# Altium schematic sheet Car.SchDoc
size A3; SheetNumber: 1; SheetTotal: 1
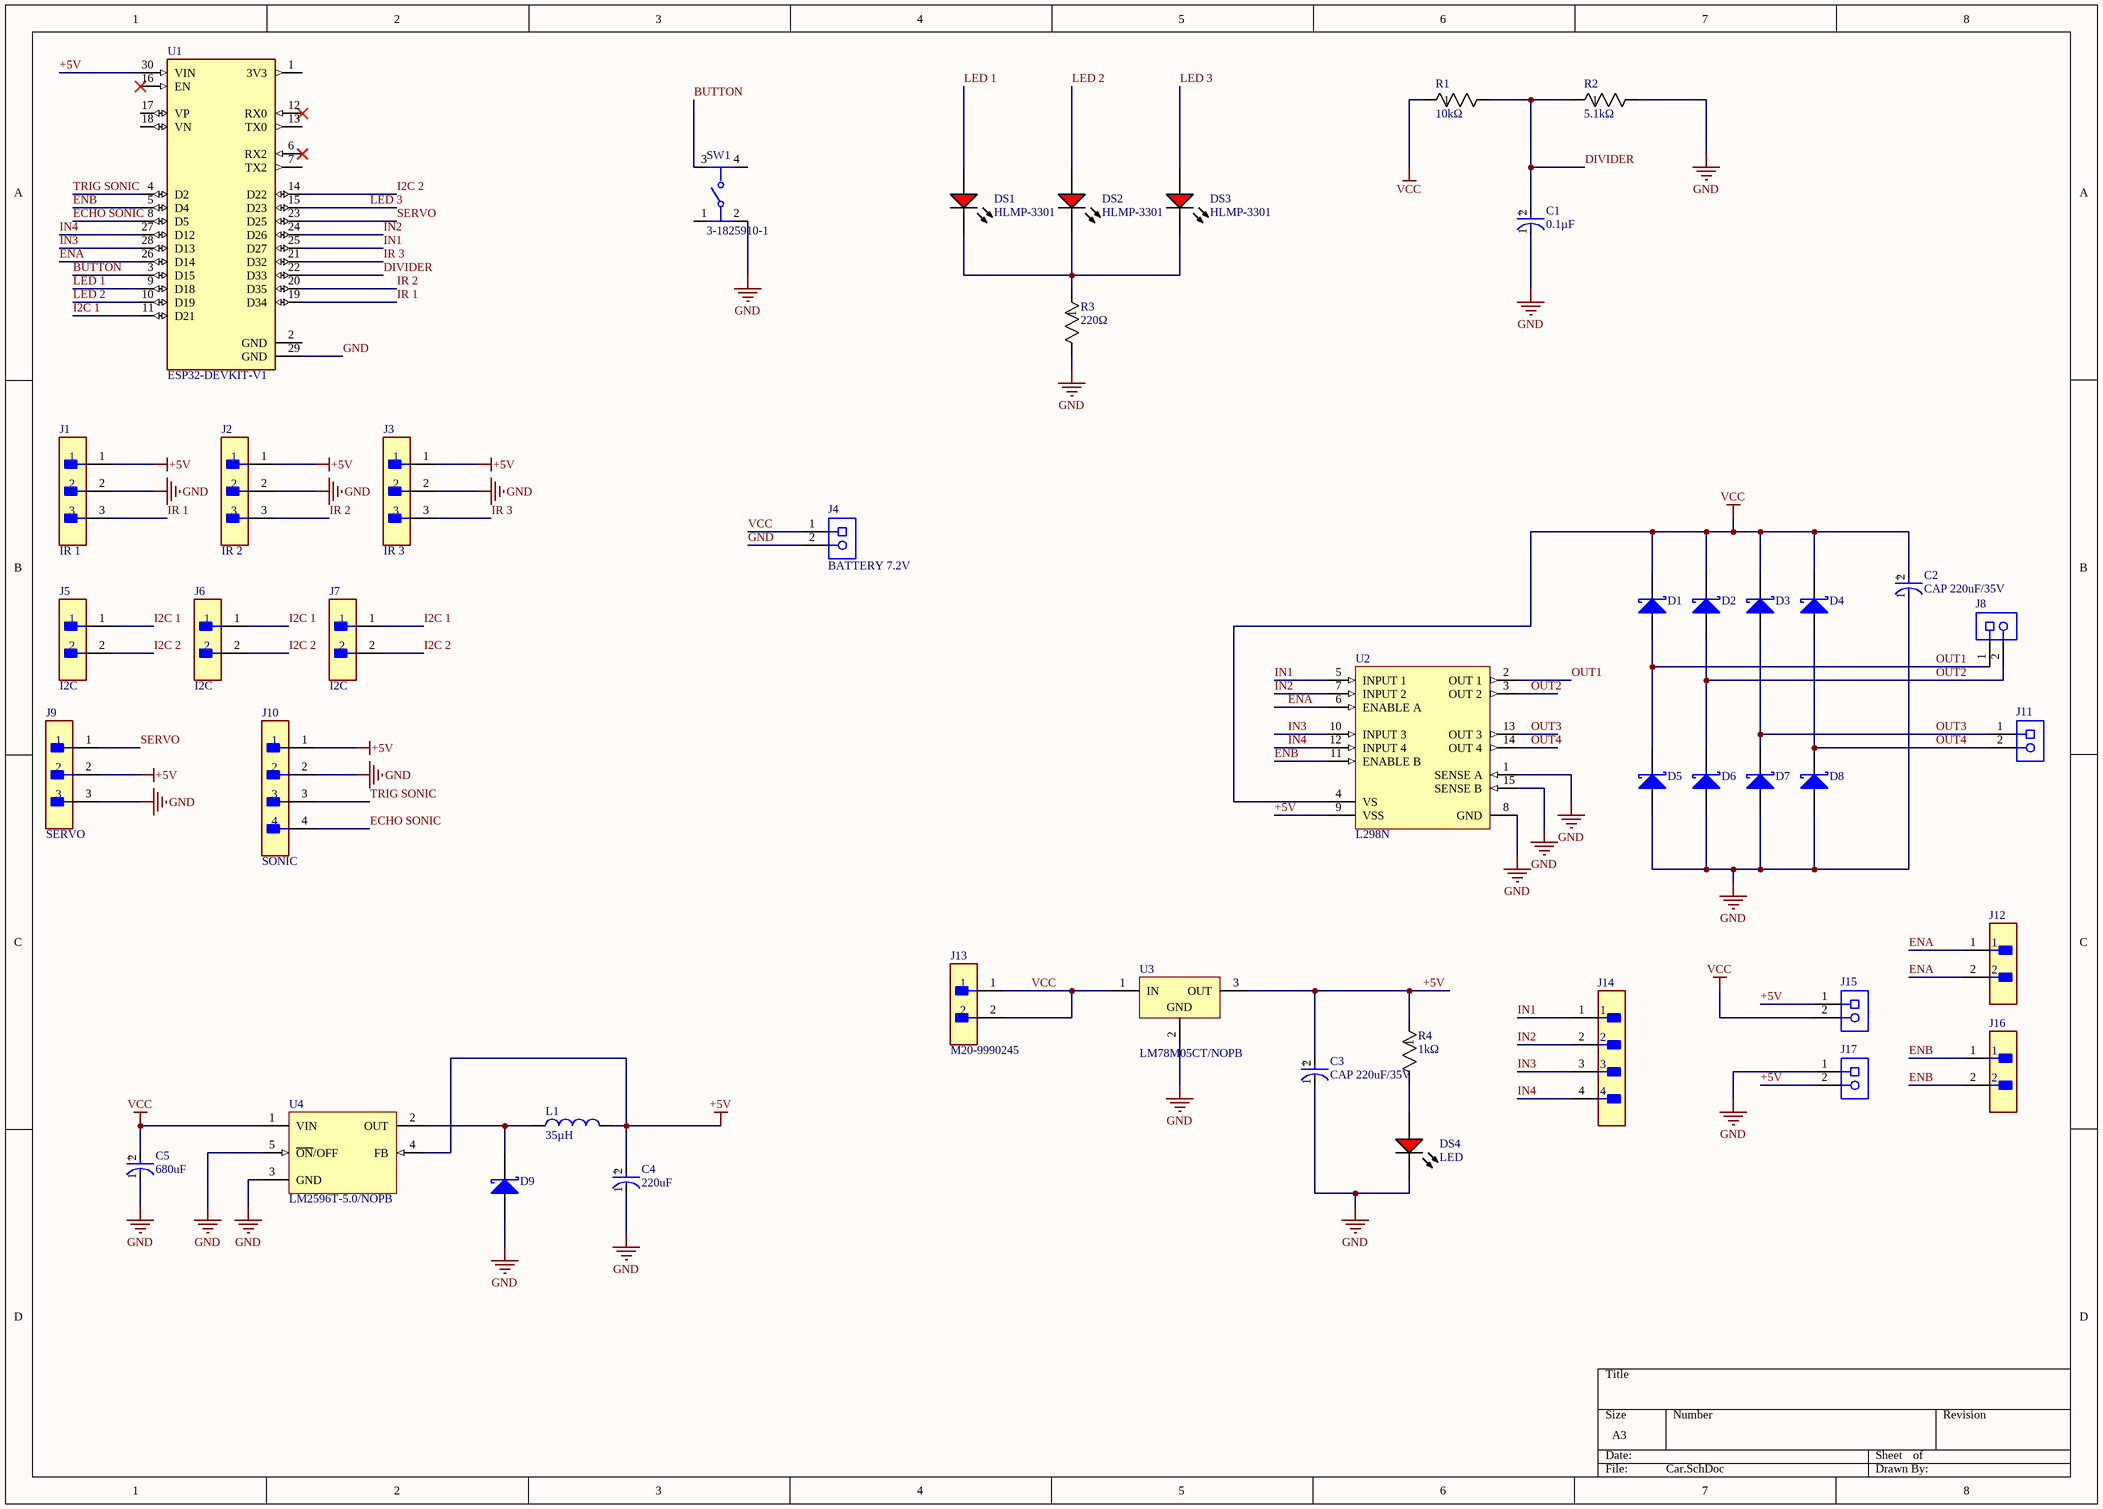
[diagram p0: Car.SchDoc]

## Parts
C1  0.1µF  [FP-EEU-FR1H101B-MFG]
C2  CAP 220uF/35V  [FP-EEU-FR1H101B-MFG]
C3  CAP 220uF/35V  [FP-EEU-FR1H101B-MFG]
C4  220uF  [FP-EEU-FR1H101B-MFG]
C5  680uF  [FP-EEU-FR1H101B-MFG]
D1  BAT46  [STM-DO-35-2]  (value not drawn)
D2  BAT46  [STM-DO-35-2]  (value not drawn)
D3  BAT46  [STM-DO-35-2]  (value not drawn)
D4  BAT46  [STM-DO-35-2]  (value not drawn)
D5  BAT46  [STM-DO-35-2]  (value not drawn)
D6  BAT46  [STM-DO-35-2]  (value not drawn)
D7  BAT46  [STM-DO-35-2]  (value not drawn)
D8  BAT46  [STM-DO-35-2]  (value not drawn)
D9  BAT46  [STM-DO-35-2]  (value not drawn)
DS1  HLMP-3301  [AVAG-HLMP-3301-2]
DS2  HLMP-3301  [AVAG-HLMP-3301-2]
DS3  HLMP-3301  [AVAG-HLMP-3301-2]
DS4  LED  [AVAG-HLMP-3301-2]
J1  IR 1  [FP-B3B-XH-A_LF_SN-MFG]
J2  IR 2  [FP-B3B-XH-A_LF_SN-MFG]
J3  IR 3  [FP-B3B-XH-A_LF_SN-MFG]
J4  BATTERY 7.2V  [PHOE-1729128-2_V]
J5  I2C  [FP-M20-9990245-MFG]
J6  I2C  [FP-M20-9990245-MFG]
J7  I2C  [FP-M20-9990245-MFG]
J8  1729128  [PHOE-1729128-2_V]  (value not drawn)
J9  SERVO  [FP-B3B-XH-A_LF_SN-MFG]
J10  SONIC  [FP-M20-9990445-MFG]
J11  1729128  [PHOE-1729128-2_V]  (value not drawn)
J12  M20-9990245  [FP-M20-9990245-MFG]  (value not drawn)
J13  M20-9990245  [FP-M20-9990245-MFG]
J14  M20-9990445  [FP-M20-9990445-MFG]  (value not drawn)
J15  1729128  [PHOE-1729128-2_V]  (value not drawn)
J16  M20-9990245  [FP-M20-9990245-MFG]  (value not drawn)
J17  1729128  [PHOE-1729128-2_V]  (value not drawn)
L1  35µH  [7447015]
R1  10kΩ  [RES_AC03_VIS]
R2  5.1kΩ  [RES_AC03_VIS]
R3  220Ω  [RES_AC03_VIS]
R4  1kΩ  [RES_AC03_VIS]
SW1  3-1825910-1  [FP-3-1825910-1-MFG]
U1  ESP32-DEVKIT-V1  [MODULE_ESP32_DEVKIT_V1]
U2  L298N  [STM-FM-15]
U3  LM78M05CT/NOPB  [NDE0003A]
U4  LM2596T-5.0/NOPB  [NDH0005A]

## Nets
+5V: C3.2(A) C4.2(A) J1.1 J2.1 J3.1 J9.2 J10.1 J15.1 J17.2 L1.2 R4.1 U1.30(VIN) U2.9(VSS) U3.3(OUT) U4.4(FB)
GND: C1.1(C) C2.1(C) C3.1(C) C4.1(C) C5.1(C) D5.1(A) D6.1(A) D7.1(A) D8.1(A) D9.1(A) DS4.1(K) J1.2 J2.2 J3.2 J4.2 J9.3 J10.2 J17.1 R2.2 R3.2 SW1.2 U1.29(GND) U2.1(SENSE_A) U2.8(GND) U2.15(SENSE_B) U3.2(GND) U4.3(GND) U4.5(~{ON}/OFF)
VCC: C2.2(A) C5.2(A) D1.2(K) D2.2(K) D3.2(K) D4.2(K) J4.1 J13.1 J13.2 J15.2 R1.1 U2.4(VS) U3.1(IN) U4.1(VIN)
BUTTON: SW1.3 U1.3(D15)
DIVIDER: C1.2(A) R1.2 R2.1 U1.22(D33)
ECHO SONIC: J10.4 U1.8(D5)
ENA: J12.1 J12.2 U1.26(D14) U2.6(ENABLE_A)
ENB: J16.1 J16.2 U1.5(D4) U2.11(ENABLE_B)
I2C 1: J5.1 J6.1 J7.1 U1.11(D21)
I2C 2: J5.2 J6.2 J7.2 U1.14(D22)
IN1: J14.1 U1.25(D27) U2.5(INPUT_1)
IN2: J14.2 U1.24(D26) U2.7(INPUT_2)
IN3: J14.3 U1.28(D13) U2.10(INPUT_3)
IN4: J14.4 U1.27(D12) U2.12(INPUT_4)
IR 1: J1.3 U1.19(D34)
IR 2: J2.3 U1.20(D35)
IR 3: J3.3 U1.21(D32)
LED 1: DS1.2(A) U1.9(D18)
LED 2: DS2.2(A) U1.10(D19)
LED 3: DS3.2(A) U1.15(D23)
OUT1: D1.1(A) D5.2(K) J8.1 U2.2(OUT_1)
OUT2: D2.1(A) D6.2(K) J8.2 U2.3(OUT_2)
OUT3: D3.1(A) D7.2(K) J11.1 U2.13(OUT_3)
OUT4: D4.1(A) D8.2(K) J11.2 U2.14(OUT_4)
SERVO: J9.1 U1.23(D25)
TRIG SONIC: J10.3 U1.4(D2)
NetD9_2: D9.2(K) L1.1 U4.2(OUT)
NetDS1_1: DS1.1(K) DS2.1(K) DS3.1(K) R3.1
NetDS4_2: DS4.2(A) R4.2

Not connected (* = marked no-connect by the designer): SW1 1 4; U1 1(3V3) 2(GND) 6(RX2)* 7(TX2) 12(RX0)* 13(TX0) 16(EN)* 17(VP) 18(VN)

## Notes on the sheet
- (in symbol CMP-05427-000020-1) +

## Library data of the parts
C1-C5 = CMP-05427-000020-1: CAP ALUM 100UF 20% 50V RADIAL; Life (Hours): 6000Hour; Ripple Current: 870mA; Lead Diameter: 0.6mm; Impedance: 61mR; Tolerance: 20%; Mount: Through Hole; Lead Free: Lead Free; Length: 11.5mm; Height - Seated (Max): 0.512inch; Contact Plating: Tin; Termination: Radial; Series: FR; Max Operating Temperature: 105°C; Features: General Purpose; Min Operating Temperature: -40°C; RoHS Compliant: Yes; Height: 11.5mm; Voltage Rating (DC): 50V; Diameter: 8mm; Capacitance: 100uF; Lead Pitch: 5mm; Radiation Hardening: No; Package Quantity: 1; Case/Package: Radial; Voltage Rating: 50V; Packaging: Tape and Reel; ESR (Equivalent Series Resistance): 61mR; REACH SVHC: No SVHC
D1-D9 = CMP-2000-05926-1: Small Signal Schottky Diode, 150 mA, 100 V, -65 to 125 degC, 2-Pin DO-35, RoHS, Tape and Reel; Manufacturer: STMicroelectronics; SVHC: NoSVHC(15-Jun-2015); Diode Configuration: Single; No. of Pins: 2Pins; Forward Surge Current Ifsm Max: 750mA; Repetitive Reverse Voltage Vrrm Max: 100V; Diode Case Style: DO-204AH; Forward Voltage VF Max: 1V; Forward Current If(AV): 150mA; Manufacturer URL: http://www.st.com/; Packaging: Tape&Reel; Package Reference: DO-35-2; Datasheet URL: http://www.st.com/content/ccc/resource/technical/document/datasheet/group1/11/76/e4/a3/df/07/49/14/CD00000767/files/CD00000767.pdf/jcr:content/translations/en.CD00000767.pdf; Diode Type: Schottky; Mounting Technology: ThroughHole; Package Description: 2-Pin Axial Lead, Dia 1.765 mm, Body Length 3.775 mm; Product Range: -; Datasheet Version: Rev. 2.1, 10/2001; Operating Temperature Max: 125°C
DS1-DS4 = CMP-2000-06411-1: T-1 3/4 (5 mm) Diffused LED Lamp, 1.9 V, -40 to 100 degC, 2-Pin THD, RoHS, Bulk; Manufacturer: Avago; Forward Current: 25mA; Forward Voltage: 2.4V; Peak Wavelength: 635nm; Shape Type: Circular; High Brightness: No; Main Category: StandardLED; Test Current (It): 10mA; Dominant Wave Length: 626nm; Number of  Elements: 1; Reverse Voltage: 5V; Chip Material: GaP; Product Height (mm): 9.19mm; Lens Type: ColoredDiffused; Viewing Angle: 60deg; Type: Uni-Color; Emitting Color: Red; Luminous Intensity: 5.4mcd; Power Dissipation: 85W; DELETED: Compliant; Product Depth (mm): 6.1mm; Package Description: 2-Pin Through Hole LED, Dia 5.85 mm; Mounting Technology: ThroughHole; Manufacturer URL: http://www.avagotech.com/; Package Type: T-13/4; Operating Temp Range: -40Cto100C; Datasheet URL: http://www.avagotech.com/docs/AV02-1558EN; Mounting: ThroughHole; Lens Dimensions: 5.08x5.08x8.3mm; Package Reference: HLMP-3301; Datasheet Version: 03/2015; Pin Count: 2; Packaging: TapeandReel; Operating Temperature Classification: Industrial; Lum Intensity: 5.4mcd; Rad Hardened: No; Product Length (mm): 6.1mm
J1-J3 J9 = CMP-17439-000014-3: CONN HEADER VERT 3POS 2.5MM; Max Voltage Rating (DC): 250V; Number of Positions: 3; Current Rating: 3A; Gender: Male; Wire/Cable Gauge: 22AWG; Contact Resistance: 20mR; Insulation Resistance: 1GR; Insulation Material: Nylon; Contact Plating: Tin; Depth: 5.75mm; Contact Type: Male Pin; Max Operating Temperature: 85°C; Insulation Color: Natural; Voltage Rating (AC): 250V; Color: Natural; Connector Type: Header; Orientation: Straight; Fastening Type: Detent; Housing Color: White; Min Operating Temperature: -25°C; Termination: Solder; Voltage Rating: 250V; Series: XH; Pitch: 2.5mm; Contact Shape: Square; Number of Rows: 1; Lead Free: Lead Free; Packaging: Bulk; Mount: Through Hole; Flammability Rating: UL94 V-0; Max Voltage Rating (AC): 250V; REACH SVHC: No SVHC; Housing Material: Polyamide; Contact Material: Brass; Lead Pitch: 2.5mm; Contact Finish - Mating: TIN; Length: 9.9mm; Max Current Rating: 3A; Number of Contacts: 3
J4 = CMP-2000-05815-1: PCB Terminal Block, 13.5 A, 400 V, 2-Pin THD, RoHS, Bulk; PartNumber: 1729128; Manufacturer: Phoenix Contact; Package Version: 03/2015; No. of Rows: 1; Pitch: 5.08mm; No. of Positions: 2; Voltage Rating: 400V; Current Rating: 13500mA; Manufacturer URL: http://www.phoenixcontact.com/; Datasheet URL: https://datasheet.ciiva.com/16046/1729128-16046181.pdf; RoHS: TRUE; Package URL: https://www.phoenixcontact.com/online/portal/pi/pxc/product_detail_page/!ut/p/b1/3VdJjqNKFDxLH8AFycySyWY2ozFsEPOMMQaDOX1XedGL_1Vdm5YXJleknhSKeBkvI6EA8ncAo3AYoDhBQGco6KN7VURTdemj9us_IEKEZo_YHiPAEWEFmDGOHMORkqKYCORBZxgL7ZoaZYcbFFUZ3fqxSY6GOuxydWUuHqz1ynmMFygu583Bob0Ewr6Sd_l-5m-kAueHiB0jpRwZwe58wwtkpxtMYd_LmGcDRU02dRNEyWt6Y2ti5pSyJ_reIkzIulrqApdnbT11V5jnCKbYNCvhEM1MCpPByat_X379-iThf08CI5GfOPqfBeS3BRoBOdD55AKVv0iLwCMq-2BrzXWSGRH7pUGD9uwXQjiph3xL0DKQwdGa0JImiIOmBNOestqgwTHSSs2oOep-78apyXQBvNi8ZLaFjvjWvcaUEBu0MC6Wbe-d6mB0FAebo2lUWinqYaZs5DAYzV0RP9yitUjnGJ0iI9xhZkT42OCQNUJJhkgWINNQLP2JFP6OpMg3JCVg70jqHT0lvKOnhHf0lPuOnnLf0VPuWx6_dxwUIvwk5WMkT0kLL1mh61l2yZVSzG3pYV_bqo-mj6uMKwKwdnnW8Jh5RTOJzMOA5c-eJDaZQw4mTMPH02PvS_ZAqNVjVTo2WyYLkwH_KU1mmmG5kjRhDqPXLwwVHvVOjCM60-fpXvTDfMGW1PVFVS1r4e4yVDk4ZdNbkUHvqPqQSeian4UD39fNKmachqdJ1NJbyk8rXT9mXTvPk3oE5meulKGgiruPJek-4I9hTT6G8ZLOyRSm2RRVbThERQad5OS28hdt4YW4vG0stgYYzsWsK4_7y6DZMjJSCqri1kyiZR5vD7pwIrNR7QwPHTcLTI5qT7eRlpHrdGiupYlqQDJ7zy_CND8fWWBoLRXxk1RVcXiBQwbTD4Xi7KL-FuO94t9xaqweXzH; Package Description: 2-Pin Through Hole Device, Body 8.1 x 10.16 mm, Pitch 5.08 mm; Datasheet Version: 12/2013; Mounting Technology: ThroughHole; Orientation: Horizontal; Package Reference: 1729128-2; Packing: Bulk
J5-J7 J12 J13 J16 = CMP-15831-000105-1: CONN HEADER VERT 2POS 2.54MM; Working Voltage: 750V; Gender: Male; Number of Poles: 2; Current Rating: 3A; Mated Stacking Heights: 16.54mm; Contact Resistance: 25mR; Connector Type: Male Pin; Insulation Resistance: 10GR; Mating Cycles: 300; Voltage: 50V; Flammability Rating: UL94 V-0; Pitch: 2.54mm; Series: M20; Number of Contacts: 2; Height: 0.12inch; Min Operating Temperature: -40°C; Contact Finish - Mating: GOLD; Number of Positions: 2; Number of Rows: 1; Packaging: Bulk; Package Quantity: 1000; Voltage Rating (AC): 750V; Current: 3A; Mount: Through Hole; Case/Package: SIL; Orientation: Straight; Contact Shape: Square; Weight: 0.25lb; Radiation Hardening: No; Fastening Type: Pull; Length: 5.08mm; Depth: 2.54mm; Contact Mating Length: 0.24inch; Housing Material: Nylon; Reach SVHC Compliant: Yes; Insulation Material: Nylon; Color: Black; Width: 0.25inch; Insulation Color: Black; Contact Material: Brass; Contact Type: Male Pin; Termination: Solder; Max Operating Temperature: 105°C; Contact Plating: Gold; Housing Color: Black; Max Current Rating: 3A; Lead Pitch: 2.54mm
J8 J11 J15 J17 = CMP-2000-05815-1: PCB Terminal Block, 13.5 A, 400 V, 2-Pin THD, RoHS, Bulk; Manufacturer: Phoenix Contact; Package Version: 03/2015; No. of Rows: 1; Pitch: 5.08mm; No. of Positions: 2; Voltage Rating: 400V; Current Rating: 13500mA; Manufacturer URL: http://www.phoenixcontact.com/; Datasheet URL: https://datasheet.ciiva.com/16046/1729128-16046181.pdf; RoHS: TRUE; Package URL: https://www.phoenixcontact.com/online/portal/pi/pxc/product_detail_page/!ut/p/b1/3VdJjqNKFDxLH8AFycySyWY2ozFsEPOMMQaDOX1XedGL_1Vdm5YXJleknhSKeBkvI6EA8ncAo3AYoDhBQGco6KN7VURTdemj9us_IEKEZo_YHiPAEWEFmDGOHMORkqKYCORBZxgL7ZoaZYcbFFUZ3fqxSY6GOuxydWUuHqz1ynmMFygu583Bob0Ewr6Sd_l-5m-kAueHiB0jpRwZwe58wwtkpxtMYd_LmGcDRU02dRNEyWt6Y2ti5pSyJ_reIkzIulrqApdnbT11V5jnCKbYNCvhEM1MCpPByat_X379-iThf08CI5GfOPqfBeS3BRoBOdD55AKVv0iLwCMq-2BrzXWSGRH7pUGD9uwXQjiph3xL0DKQwdGa0JImiIOmBNOestqgwTHSSs2oOep-78apyXQBvNi8ZLaFjvjWvcaUEBu0MC6Wbe-d6mB0FAebo2lUWinqYaZs5DAYzV0RP9yitUjnGJ0iI9xhZkT42OCQNUJJhkgWINNQLP2JFP6OpMg3JCVg70jqHT0lvKOnhHf0lPuOnnLf0VPuWx6_dxwUIvwk5WMkT0kLL1mh61l2yZVSzG3pYV_bqo-mj6uMKwKwdnnW8Jh5RTOJzMOA5c-eJDaZQw4mTMPH02PvS_ZAqNVjVTo2WyYLkwH_KU1mmmG5kjRhDqPXLwwVHvVOjCM60-fpXvTDfMGW1PVFVS1r4e4yVDk4ZdNbkUHvqPqQSeian4UD39fNKmachqdJ1NJbyk8rXT9mXTvPk3oE5meulKGgiruPJek-4I9hTT6G8ZLOyRSm2RRVbThERQad5OS28hdt4YW4vG0stgYYzsWsK4_7y6DZMjJSCqri1kyiZR5vD7pwIrNR7QwPHTcLTI5qT7eRlpHrdGiupYlqQDJ7zy_CND8fWWBoLRXxk1RVcXiBQwbTD4Xi7KL-FuO94t9xaqweXzH; PartNumber: 1729128; Package Description: 2-Pin Through Hole Device, Body 8.1 x 10.16 mm, Pitch 5.08 mm; Datasheet Version: 12/2013; Mounting Technology: ThroughHole; Orientation: Horizontal; Package Reference: 1729128-2; Packing: Bulk
J10 J14 = CMP-00671-05399696-1: M20-9990445 Conn Unshrouded Header HDR 4 POS 2.54mm Solder ST Thru-Hole Bulk/Loose; Insulation Resistance: 10GΩ; Connector Type: Male Pin; Voltage Rating (DC): 750V; Max Current Rating: 3A; Contact Resistance: 25mΩ; Number of Contacts: 4; Gender: Male; Color: Black; Height: 2.54mm; Contact Material: Brass, Bronze, Gold, Nickel; Orientation: Straight; Width: 12.7mm; Mount: Through Hole; Pitch: 2.54mm; Lead Pitch: 2.54mm; RoHS: Compliant; Max Operating Temperature: 105°C; Case/Package: SIL; NexarPartId: 5399696; Depth: 2.54mm; Length: 10.16mm; Current Rating: 3A; Contact Plating: Gold; Radiation Hardening: No; Contact Mating Length: 6.096mm; Voltage Rating (AC): 750V; Termination: Solder; REACH SVHC: No SVHC; Weight: 45.359237g; Number of Rows: 1; Min Operating Temperature: -40°C; Housing Material: Nylon; Housing Color: Black; Number of Positions: 4; Number of Pins: 4
L1 = CMP-03913-22866857-1: 7447015 35 µH ±20% Ferrite, Iron Powder Leaded Inductor, 5.7A Idc, 25mO Rdc WE-FI; Pin Length: 15mm; Test Frequency: 10kHz; Max DC Current: 3A; Core Material: Composite, Ferrite; Shielding: Unshielded; DC Resistance (DCR): 25mΩ; NexarPartId: 22866857; Case/Package: Radial; Length: 18.5mm; Min Operating Temperature: -40°C; Depth: 9.5mm; Diameter: 18.5mm; Number of Pins: 2; Termination: Through Hole; Inductance: 35µH; RoHS: Compliant; Packaging: Bulk; Width: 11mm; Max Operating Temperature: 105°C; RMS Current (Irms): 3A; Ambient Temperature Range Low: -40°C; Lead Pitch: 8mm; Ambient Temperature Range High: 65°C; Tolerance: 20%; Inductance Tolerance: 20%; REACH SVHC: Unknown; Mount: Through Hole, Wire; Current Rating: 5.7A
R1-R4 = CMP-00030-39746358-1: AC03000001000JAC00 VISHAY AC03000001000JAC00 Through Hole Resistor, 100 ohm, Axial Leaded, 3 W, 5%, AC Series; Voltage Rating: 17V; Lead Diameter: 800µm; Temperature Coefficient: -80ppm/°C; Resistance: 100Ω; Max Power Dissipation: 3W; Features: Flame Retardant Coating; Number of Pins: 2; Military Standard: Not; Voltage Rating (DC): 17V; Termination: Axial; Width: 4.8mm; Tolerance: 5%; Diameter: 4.8mm; Schedule B: 8533210080, 8533210080; Contact Plating: Tin; NexarPartId: 39746358; RoHS: Compliant; Composition: Wirewound; Max Operating Temperature: 275°C; Packaging: Cut Tape (CT); Number of Terminations: 2; REACH SVHC: Unknown; Power Rating: 3W; Case/Package: Conformal; Radiation Hardening: No; Min Operating Temperature: 0°C; Length: 13mm
SW1 = CMP-03407-000001-1: SWITCH TACTILE SPST-NO 0.05A 24V; Manufacturer: TE Connectivity; Operating Force: 160gf; Contact Current Rating: 50mA; Contact Resistance: 100mΩ; Electromechanical Life: 100000Cycles; Device Class L1: Electromechanical; ComponentLink2URL: https://www.te.com/commerce/DocumentDelivery/DDEController?Action=srchrtrv&DocNm=1825910&DocType=Customer+Drawing&DocLang=English; Category: Switch; Device Class L2: Switches; Temperature: -35°C to +85°C; RoHS: TRUE; Mount: Through Hole; Manufacturer Part Number: 3-1825910-1; Automotive: No; Lead Free: Yes; Device Class L3: Tactile Switches; ComponentLink2Description: Datasheet; Temperature Range High: +85°C; Height: 17.3mm; Package: 0; Temperature Range Low: -35°C; Throw Configuration: SPST-NO; Digikey Description: SWITCH TACTILE SPST-NO 0.05A 24V; Octopart: https://octopart.com/3-1825910-1-te+connectivity-46506874
U1 = ESP32-DEVKIT-V1: Dual core, Wi-Fi: 2.4 GHz up to 150 Mbits/s,BLE (Bluetooth Low Energy) and legacy Bluetooth, 32 bits, Up to 240 MHz; MF: Do it; SnapEDA_Link: https://www.snapeda.com/parts/ESP32-DEVKIT-V1/Do+it/view-part/?ref=snap; Package: None; Value: *; MP: ESP32-DEVKIT-V1; Check_prices: https://www.snapeda.com/parts/ESP32-DEVKIT-V1/Do+it/view-part/?ref=eda
U2 = CMP-2000-06526-1: Dual Full-Bridge Driver, 4.8 to 46 V, -40 to 150 degC, 15-Pin FM (MW 15L), RoHS, Tube; Manufacturer: STMicroelectronics; PartNumber: L298; Output Current: 2A; Supply Voltage Max: 7V; Driver Case Style: Multiwatt; Supply Voltage Min: 4.5V; No. of Pins: 15Pins; SVHC: NoSVHC(17-Dec-2015); Output Voltage: 46V; No. of Outputs: 4Outputs; Motor Type: FullBridge; MSL: -; Package Description: 15-Pin Flange Mount, Body 5 x 19.6 mm, Pitch 1.27 mm; Datasheet Version: 01/2000; Package Reference: FM-15; Mounting Technology: ThroughHole; Packaging: Each; Automotive Qualification Standard: -; Product Range: -; Datasheet URL: https://datasheet.ciiva.com/15109/getdatasheetpartid-50682-15109332.pdf; Operating Temperature Max: 130°C; Operating Temperature Min: -25°C; Manufacturer URL: http://www.st.com/
U3 = CMP-0062-02482-3: 3-Terminal Positive Voltage Regulators, 3-pin TO-220, Pb-Free; Manufacturer: Texas Instruments; PackageTopMarking: NSUZXYTTE#*LM341T-5.0*LM78M05CT; PowerWise: N; CompType: LDO IC; PackageDescription: TO-220, Molded, 3 Lead, Straight; ComponentLink1URL: http://www.ti.com/general/docs/lit/getliterature.tsp?genericPartNumber=LM78M05&fileType=pdf; ComponentLink1Description: Datasheet URL; RoHS: Y; PinCount: 3; PackageReference: NDE0003A
U4 = CMP-0069-01926-3: SIMPLE SWITCHER® Power Converter 150 KHz 3A Step-Down Voltage Regulator, 5-pin TO-220, Pb-Free; Manufacturer: Texas Instruments; PowerWise: N; PackageTopMarking: NSUZXYTTE#*LM2596T*-5.0 P+; ComponentLink1URL: http://www.ti.com/general/docs/lit/getliterature.tsp?genericPartNumber=LM2596&fileType=pdf; PackageDescription: TO-220, Molded, Stagger Bend, 5 Lead; ComponentLink1Description: Datasheet URL; PinCount: 5; RoHS: Y; CompType: Switcher; PackageReference: NDH0005A